# EAGLE schematic DK_D1_RS232_V5 (EAGLE 9.6.2)
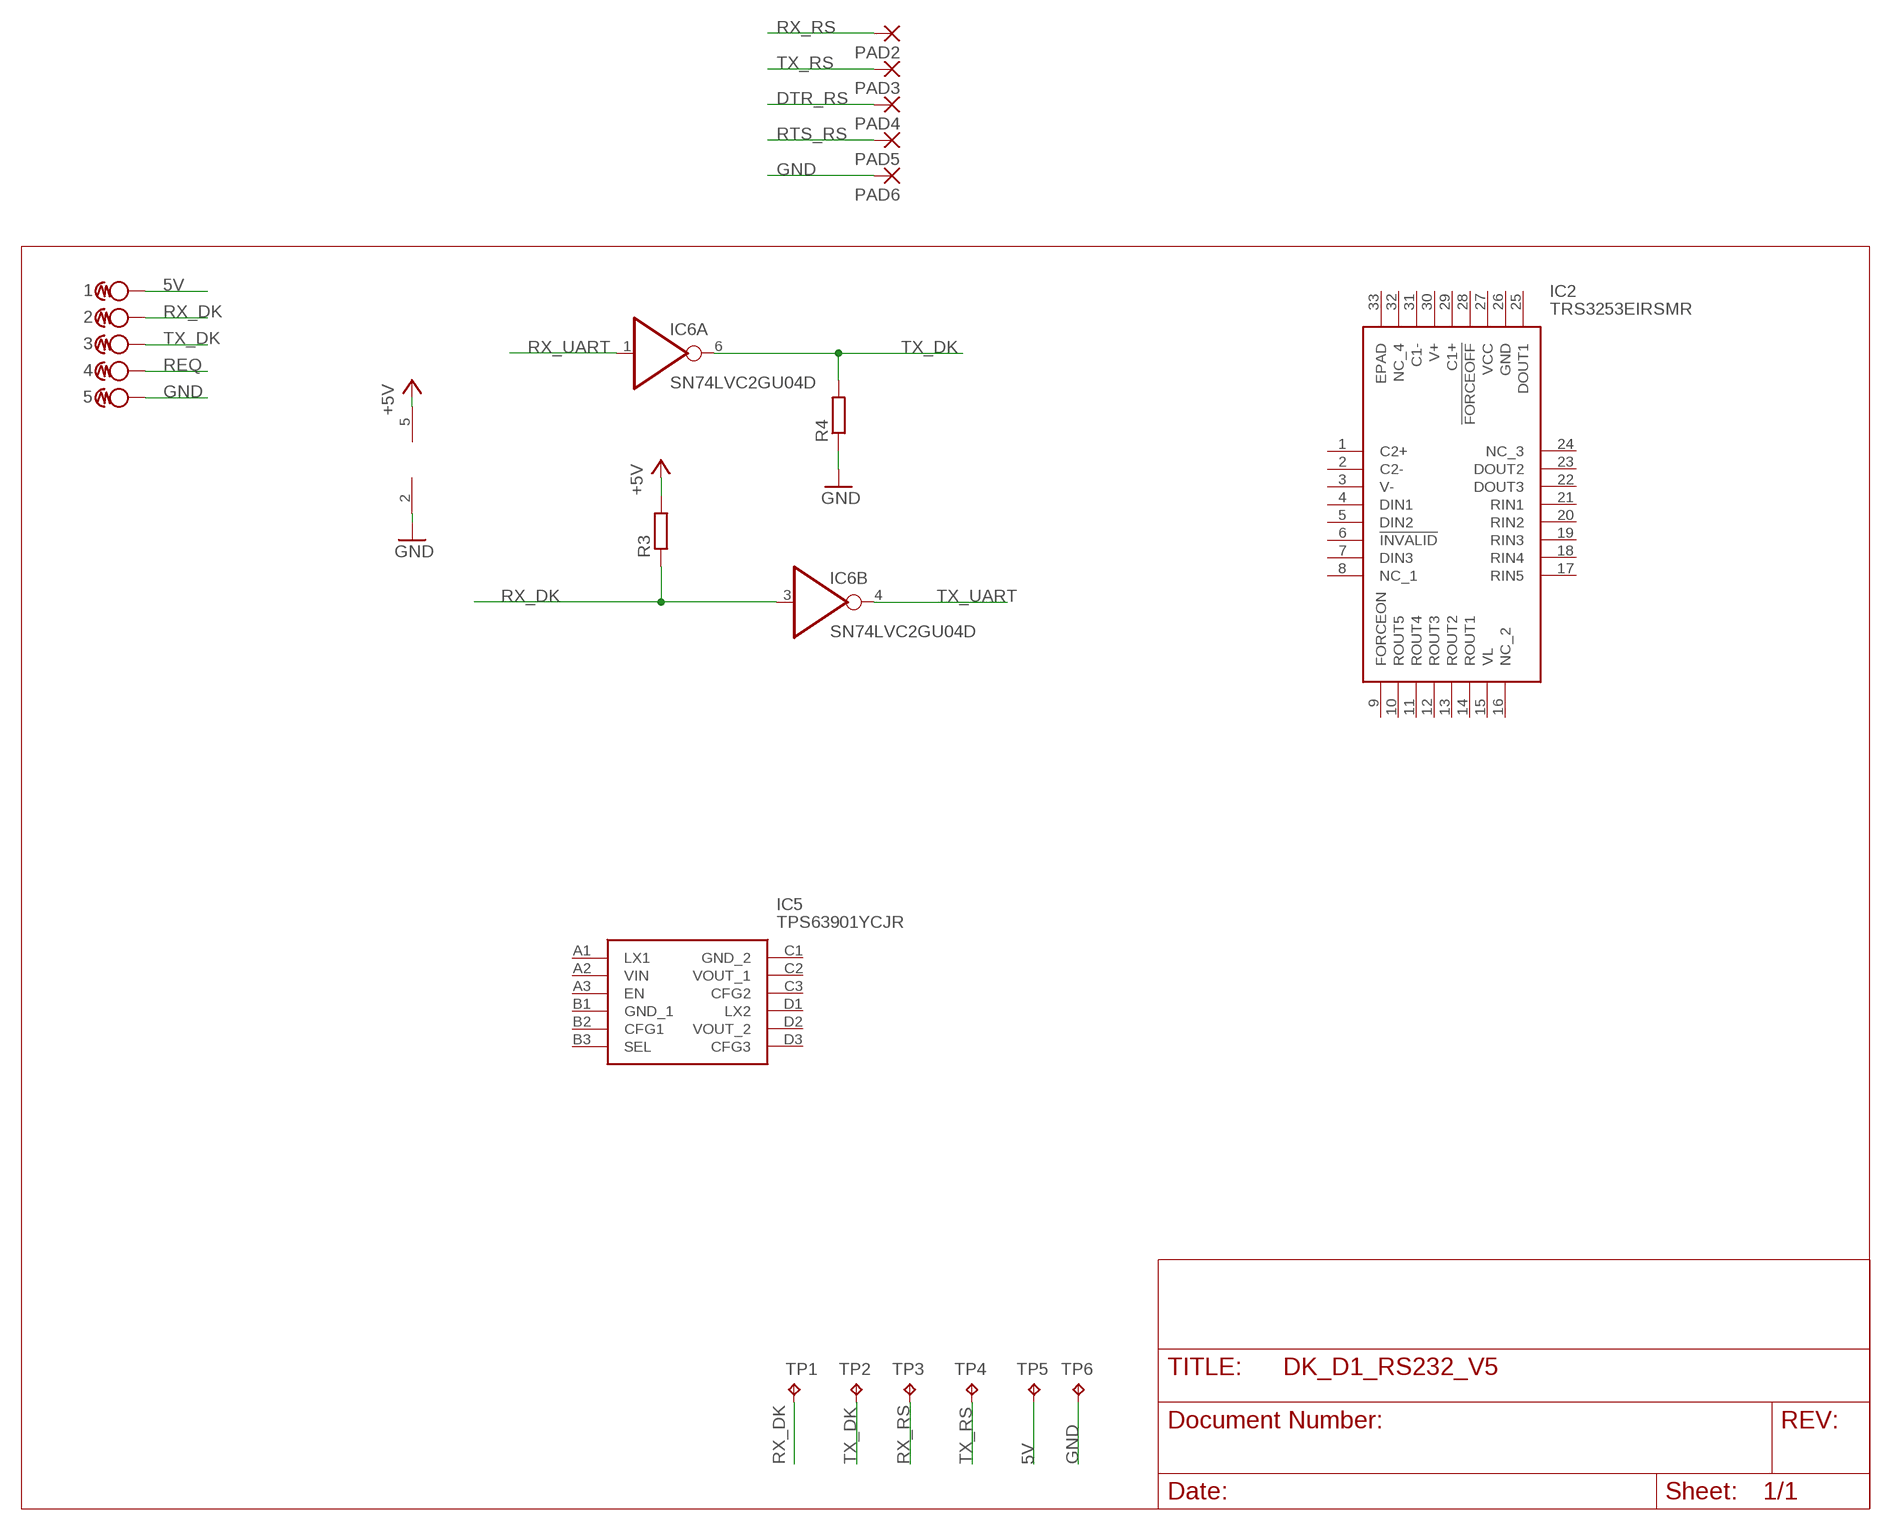
[diagram p0: schematic, sheet 1]

## Parts
1  0975-0-15-20-80-14-11-0  [0975-0-15-20-80-14-11-0]
2  0975-0-15-20-80-14-11-0  [0975-0-15-20-80-14-11-0]
3  0975-0-15-20-80-14-11-0  [0975-0-15-20-80-14-11-0]
4  0975-0-15-20-80-14-11-0  [0975-0-15-20-80-14-11-0]
5  0975-0-15-20-80-14-11-0  [0975-0-15-20-80-14-11-0]
IC2  TRS3253EIRSMR  [QFN40P400X400X100-33N]
IC5  TPS63901YCJR  [BGA12C35P3X4_111X146X35]
IC6  SN74LVC2GU04D  [DBV6]
PAD2  1,6/0,8  [1,6/0,8]
PAD3  1,6/0,8  [1,6/0,8]
PAD4  1,6/0,8  [1,6/0,8]
PAD5  1,6/0,8  [1,6/0,8]
PAD6  1,6/0,8  [1,6/0,8]
R3  R-EU_R0603  [R0603]
R4  R-EU_R0603  [R0603]
TP1  TPB1,27  [B1,27]
TP2  TPB1,27  [B1,27]
TP3  TPB1,27  [B1,27]
TP4  TPB1,27  [B1,27]
TP5  TPB1,27  [B1,27]
TP6  TPB1,27  [B1,27]

## Nets
5V: 1.P$1 TP5.TP
+5V: IC6.5(C:5V) R3.2
DTR_RS: PAD4.1(P)
GND: 5.P$1 IC6.2(C:GND) PAD6.1(P) R4.1 TP6.TP
REQ: 4.P$1
RTS_RS: PAD5.1(P)
RX_DK: 2.P$1 IC6.3(B:A) R3.1 TP1.TP
RX_RS: PAD2.1(P) TP3.TP
RX_UART: IC6.1(A:A)
TX_DK: 3.P$1 IC6.6(A:Y) R4.2 TP2.TP
TX_RS: PAD3.1(P) TP4.TP
TX_UART: IC6.4(B:Y)
Unconnected: IC2.1(C2+) IC2.2(C2-) IC2.3(V-) IC2.4(DIN1) IC2.5(DIN2) IC2.6(!INVALID) IC2.7(DIN3) IC2.8(NC_1) IC2.9(FORCEON) IC2.10(ROUT5) IC2.11(ROUT4) IC2.12(ROUT3) IC2.13(ROUT2) IC2.14(ROUT1) IC2.15(VL) IC2.16(NC_2) IC2.17(RIN5) IC2.18(RIN4) IC2.19(RIN3) IC2.20(RIN2) IC2.21(RIN1) IC2.22(DOUT3) IC2.23(DOUT2) IC2.24(NC_3) IC2.25(DOUT1) IC2.26(GND) IC2.27(VCC) IC2.28(!FORCEOFF) IC2.29(C1+) IC2.30(V+) IC2.31(C1-) IC2.32(NC_4) IC2.33(EPAD) IC5.A1(LX1) IC5.A2(VIN) IC5.A3(EN) IC5.B1(GND_1) IC5.B2(CFG1) IC5.B3(SEL) IC5.C1(GND_2) IC5.C2(VOUT_1) IC5.C3(CFG2) IC5.D1(LX2) IC5.D2(VOUT_2) IC5.D3(CFG3)

## Library data of the parts
1-5 = pogo-pins:0975-0-15-20-80-14-11-0
IC2 = TRS3253EIRSMR:TRS3253EIRSMR: Texas Instruments TRS3253EIRSMR, Line Transceiver, RS-232 3-TX 5-RX, 3 5.5 V, 32-Pin QFN Source: Datasheet <http://www.ti.com/lit/gpn/trs3253e>; DESCRIPTION: Texas Instruments TRS3253EIRSMR, Line Transceiver, RS-232 3-TX 5-RX, 3 5.5 V, 32-Pin QFN; HEIGHT: 1mm; MANUFACTURER_NAME: Texas Instruments; MANUFACTURER_PART_NUMBER: TRS3253EIRSMR; MOUSER_PART_NUMBER: 595-TRS3253EIRSMR; MOUSER_PRICE-STOCK: https://www.mouser.co.uk/ProductDetail/Texas-Instruments/TRS3253EIRSMR/?qs=nRD1PKnFC2EXDSNs7uJ62g%3D%3D
IC5 = TPS63901YCJR:TPS63901YCJR: 5.5-V buck-boost converter with 75-nA operating IQ in WCSP package Source: Datasheet <https://www.ti.com/lit/ds/symlink/tps63901.pdf?ts=1658737279065&ref_url=https%3A%2F%2Fwww.ti.com%2Fproduct%2FTPS63901%3FkeyMatch%3DTPS63901YCJR%26tisearch%3Dsearch-everything%26usecase%3DOPN>; DESCRIPTION: 5.5-V buck-boost converter with 75-nA operating IQ in WCSP package; HEIGHT: 0.35mm; MANUFACTURER_NAME: Texas Instruments; MANUFACTURER_PART_NUMBER: TPS63901YCJR; MOUSER_PART_NUMBER: 595-TPS63901YCJR; MOUSER_PRICE-STOCK: https://www.mouser.co.uk/ProductDetail/Texas-Instruments/TPS63901YCJR?qs=vvQtp7zwQdNZy3FE2e2hqg%3D%3D
IC6 = sn74lvc:SN74LVC2GU04D
PAD2-PAD6 = wirepad:1,6/0,8: THROUGH-HOLE PAD
R3 R4 = rcl:R-EU_: RESISTOR, European symbol; SPICEPREFIX: R
TP1-TP6 = testpad:TP: Test pad